# Altium project smartmcu.PrjPcb
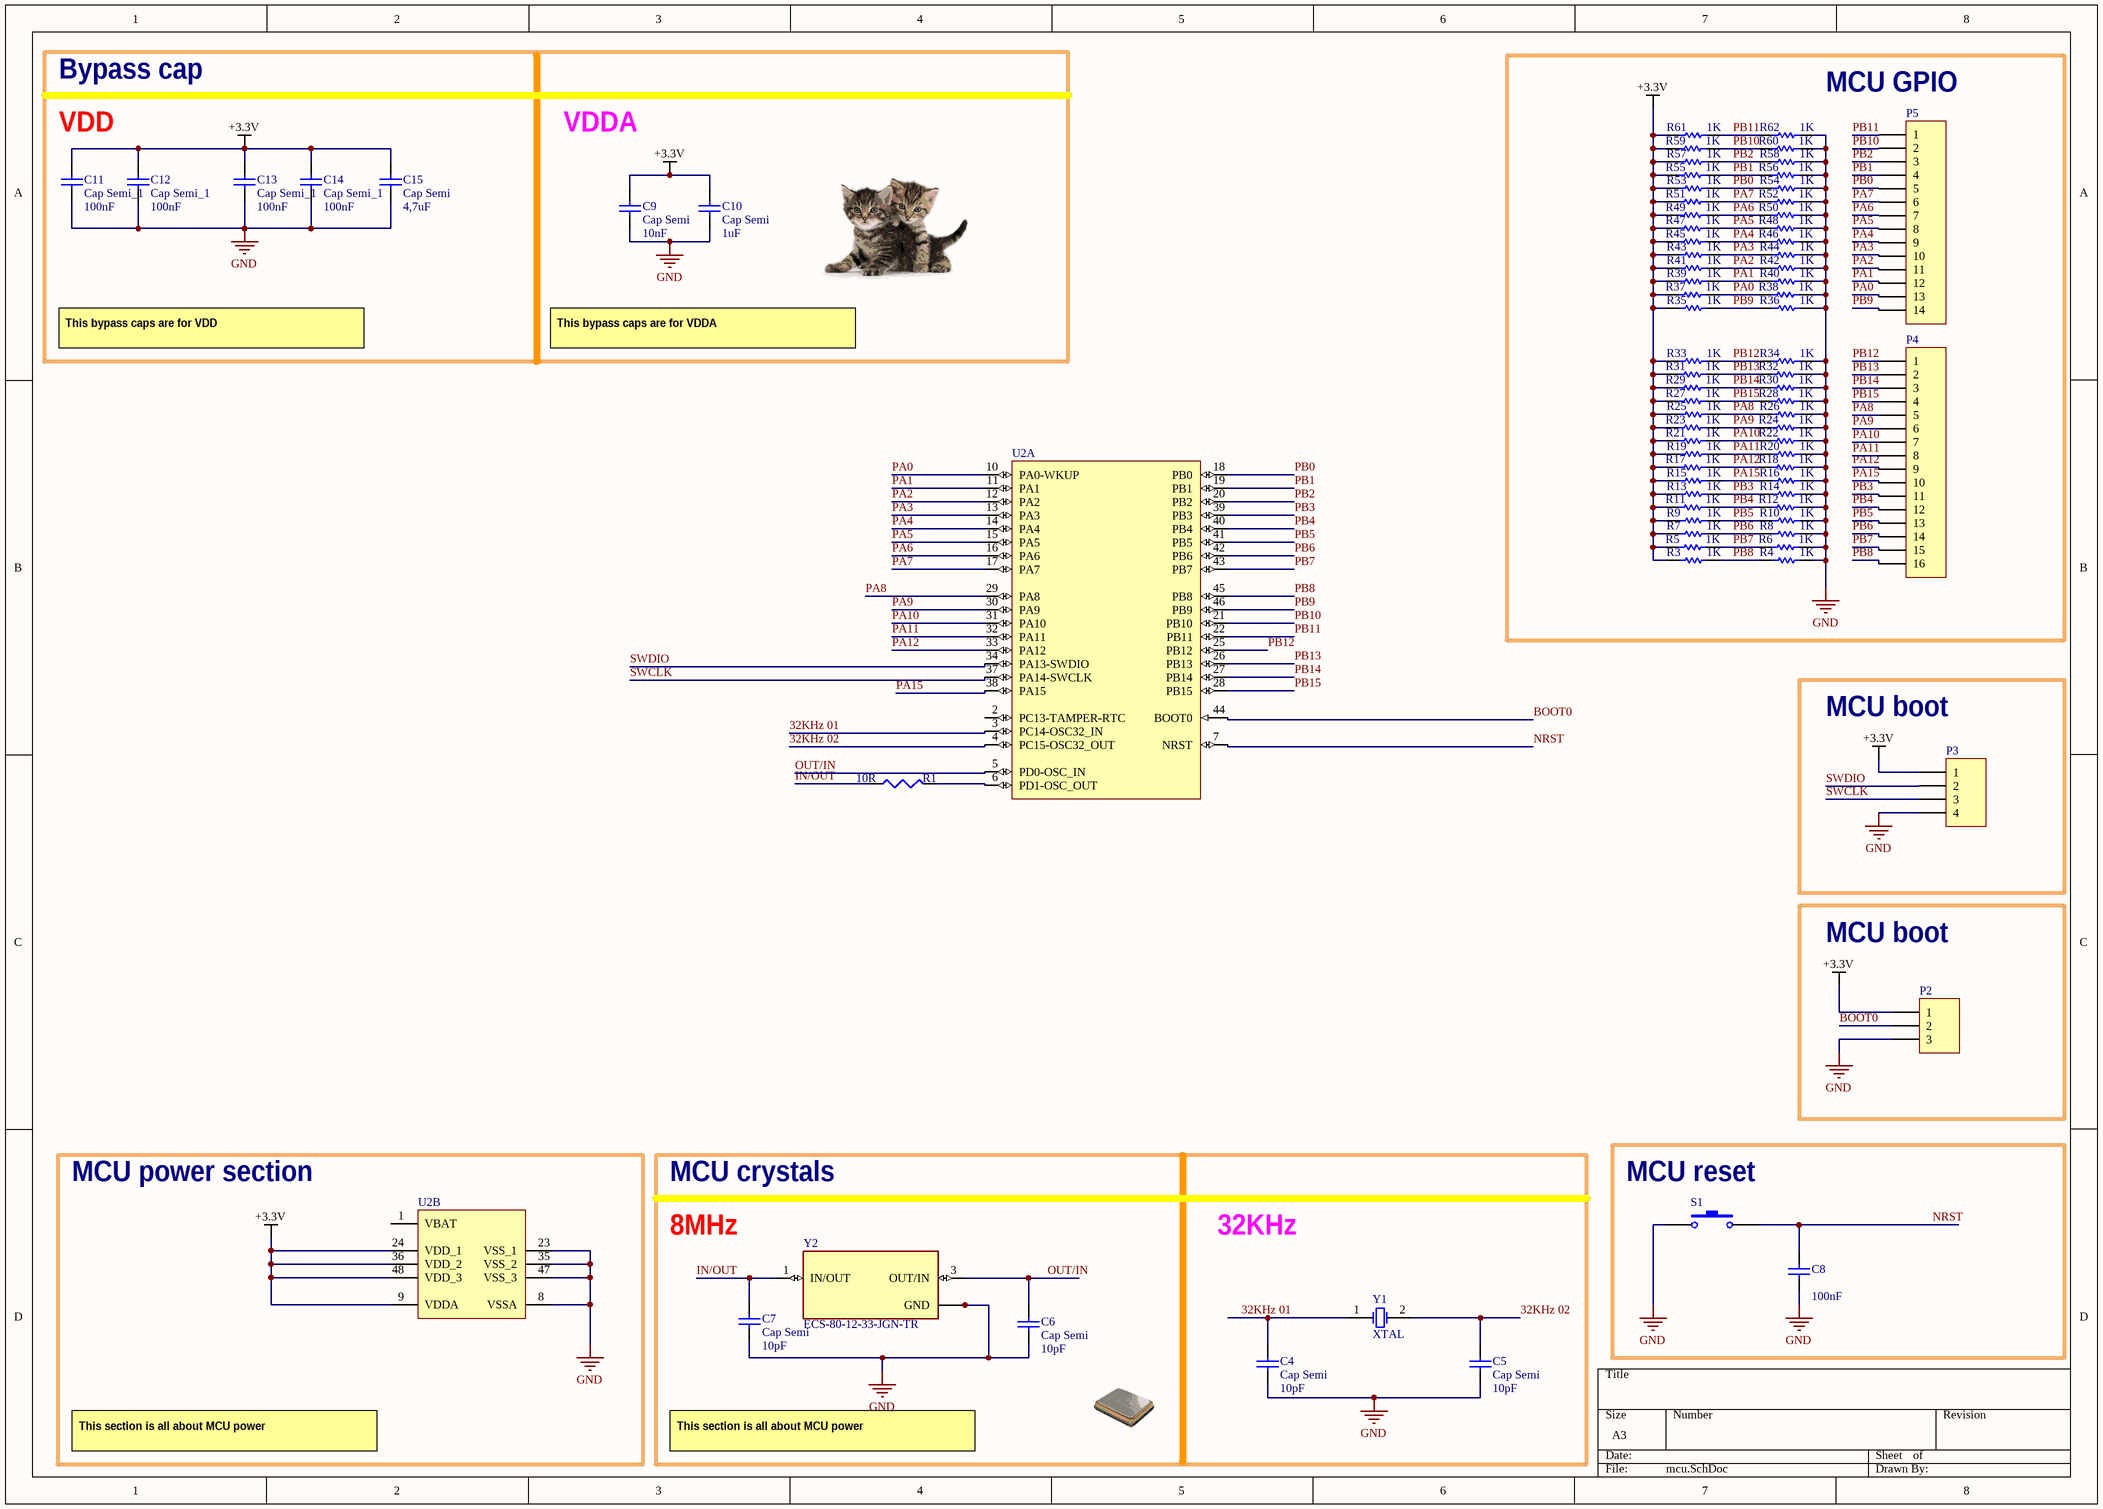
[diagram p0: mcu.SchDoc]
date: 2023; designer: Igor Vashkevich; my tittle: smart mcu project
3 sheets, 88 parts. Net scope: global (net labels, ports and power ports of the same name join across sheets).
Board file: smarmcuPcb.PcbDoc
Sheets:
  main.SchDoc
  mcu.SchDoc
  PowerSupply.SchDoc

## Sheet main.SchDoc
size A4; Author: Igor Vashkevich; SheetNumber: 1; SheetTotal: 3

## Sheet mcu.SchDoc
size A3; SheetNumber: 2; SheetTotal: 3

### Parts
C4  Cap Semi  value 10pF  [0402]
C5  Cap Semi  value 10pF  [0402]
C6  Cap Semi  value 10pF  [0402]
C7  Cap Semi  value 10pF  [0402]
C8  value 100nF  [1608[0603]]
C9  Cap Semi  value 10nF  [1608[0603]]
C10  Cap Semi  value 1uF  [1608[0603]]
C11  Cap Semi_1  value 100nF  [1608[0603]cap]
C12  Cap Semi_1  value 100nF  [1608[0603]cap]
C13  Cap Semi_1  value 100nF  [1608[0603]cap]
C14  Cap Semi_1  value 100nF  [1608[0603]cap]
C15  Cap Semi  value 4,7uF  [1608[0603]cap]
P2  (no value)  [MHDR1X3body]
P3  (no value)  [MHDR1X4body]
P4  Header 16  [MY_FE16]  (value not drawn)
P5  Header 14  [MY_FE14]  (value not drawn)
R1  value 10R  [J1-0603]  (hidden comment: Res3)
R3  1K  [MY_0603]
R4  1K  [MY_0603]
R5  1K  [MY_0603]
R6  1K  [MY_0603]
R7  1K  [MY_0603]
R8  1K  [MY_0603]
R9  1K  [MY_0603]
R10  1K  [MY_0603]
R11  1K  [MY_0603]
R12  1K  [MY_0603]
R13  1K  [MY_0603]
R14  1K  [MY_0603]
R15  1K  [MY_0603]
R16  1K  [MY_0603]
R17  1K  [MY_0603]
R18  1K  [MY_0603]
R19  1K  [MY_0603]
R20  1K  [MY_0603]
R21  1K  [MY_0603]
R22  1K  [MY_0603]
R23  1K  [MY_0603]
R24  1K  [MY_0603]
R25  1K  [MY_0603]
R26  1K  [MY_0603]
R27  1K  [MY_0603]
R28  1K  [MY_0603]
R29  1K  [MY_0603]
R30  1K  [MY_0603]
R31  1K  [MY_0603]
R32  1K  [MY_0603]
R33  1K  [MY_0603]
R34  1K  [MY_0603]
R35  1K  [MY_0603]
R36  1K  [MY_0603]
R37  1K  [MY_0603]
R38  1K  [MY_0603]
R39  1K  [MY_0603]
R40  1K  [MY_0603]
R41  1K  [MY_0603]
R42  1K  [MY_0603]
R43  1K  [MY_0603]
R44  1K  [MY_0603]
R45  1K  [MY_0603]
R46  1K  [MY_0603]
R47  1K  [MY_0603]
R48  1K  [MY_0603]
R49  1K  [MY_0603]
R50  1K  [MY_0603]
R51  1K  [MY_0603]
R52  1K  [MY_0603]
R53  1K  [MY_0603]
R54  1K  [MY_0603]
R55  1K  [MY_0603]
R56  1K  [MY_0603]
R57  1K  [MY_0603]
R58  1K  [MY_0603]
R59  1K  [MY_0603]
R60  1K  [MY_0603]
R61  1K  [MY_0603]
R62  1K  [MY_0603]
S1  (no value)  [SPST-2_body]
U2  (no value)  [STM-LQFP48_N]  (parts A,B of 2)
Y1  XTAL  [R38]
Y2  ECS-80-12-33-JGN-TR  [XTAL_ECS-240-8-33-AGN-TR]

### Blocks framed on the sheet
MCU GPIO: P4 P5 R3-R62
MCU boot: P3
MCU boot: P2
MCU reset: C8 S1
MCU power section: U2

### Nets
+3.3V: C9.2 C10.2 C11.2 C12.2 C13.2 C14.2 C15.2 P2.1 P3.1 R3.1 R5.1 R7.1 R9.1 R11.1 R13.1 R15.1 R17.1 R19.1 R21.1 R23.1 R25.1 R27.1 R29.1 R31.1 R33.1 R35.1 R37.1 R39.1 R41.1 R43.1 R45.1 R47.1 R49.1 R51.1 R53.1 R55.1 R57.1 R59.1 R61.1 U2.9(VDDA) U2.24(VDD_1) U2.36(VDD_2) U2.48(VDD_3)
GND: C4.1 C5.1 C6.1 C7.1 C8.1 C9.1 C10.1 C11.1 C12.1 C13.1 C14.1 C15.1 P2.3 P3.4 R4.2 R6.2 R8.2 R10.2 R12.2 R14.2 R16.2 R18.2 R20.2 R22.2 R24.2 R26.2 R28.2 R30.2 R32.2 R34.2 R36.2 R38.2 R40.2 R42.2 R44.2 R46.2 R48.2 R50.2 R52.2 R54.2 R56.2 R58.2 R60.2 R62.2 S1.1 U2.8(VSSA) U2.23(VSS_1) U2.35(VSS_2) U2.47(VSS_3) Y2.2(GND) Y2.4(GND)
32KHz 01: C4.2 U2.3(PC14-OSC32_IN) Y1.1(OSC1)
32KHz 02: C5.2 U2.4(PC15-OSC32_OUT) Y1.2(OSC2)
BOOT0: P2.2 U2.44(BOOT0)
IN/OUT: C7.2 R1.1 Y2.1(IN/OUT)
NRST: C8.2 S1.2 U2.7(NRST)
OUT/IN: C6.2 U2.5(PD0-OSC_IN) Y2.3(OUT/IN)
PA0: P5.13 R37.2 R38.1 U2.10(PA0-WKUP)
PA1: P5.12 R39.2 R40.1 U2.11(PA1)
PA2: P5.11 R41.2 R42.1 U2.12(PA2)
PA3: P5.10 R43.2 R44.1 U2.13(PA3)
PA4: P5.9 R45.2 R46.1 U2.14(PA4)
PA5: P5.8 R47.2 R48.1 U2.15(PA5)
PA6: P5.7 R49.2 R50.1 U2.16(PA6)
PA7: P5.6 R51.2 R52.1 U2.17(PA7)
PA8: P4.5 R25.2 R26.1 U2.29(PA8)
PA9: P4.6 R23.2 R24.1 U2.30(PA9)
PA10: P4.7 R21.2 R22.1 U2.31(PA10)
PA11: P4.8 R19.2 R20.1 U2.32(PA11)
PA12: P4.9 R17.2 R18.1 U2.33(PA12)
PA15: P4.10 R15.2 R16.1 U2.38(PA15)
PB0: P5.5 R53.2 R54.1 U2.18(PB0)
PB1: P5.4 R55.2 R56.1 U2.19(PB1)
PB2: P5.3 R57.2 R58.1 U2.20(PB2)
PB3: P4.11 R13.2 R14.1 U2.39(PB3)
PB4: P4.12 R11.2 R12.1 U2.40(PB4)
PB5: P4.13 R9.2 R10.1 U2.41(PB5)
PB6: P4.14 R7.2 R8.1 U2.42(PB6)
PB7: P4.15 R5.2 R6.1 U2.43(PB7)
PB8: P4.16 R3.2 R4.1 U2.45(PB8)
PB9: P5.14 R35.2 R36.1 U2.46(PB9)
PB10: P5.2 R59.2 R60.1 U2.21(PB10)
PB11: P5.1 R61.2 R62.1 U2.22(PB11)
PB12: P4.1 R33.2 R34.1 U2.25(PB12)
PB13: P4.2 R31.2 R32.1 U2.26(PB13)
PB14: P4.3 R29.2 R30.1 U2.27(PB14)
PB15: P4.4 R27.2 R28.1 U2.28(PB15)
SWCLK: P3.3 U2.37(PA14-SWCLK)
SWDIO: P3.2 U2.34(PA13-SWDIO)
NetR1_2: R1.2 U2.6(PD1-OSC_OUT)

Not connected (* = marked no-connect by the designer): U2 1(VBAT) 2(PC13-TAMPER-RTC)

### Notes on the sheet
- Bypass cap
- VDD
- VDDA
- This bypass caps are for VDD
- This bypass caps are for VDDA
- MCU crystals
- 8MHz
- 32KHz
- This section is all about MCU power

### Library data of the parts
C4-C10 C15 = Cap Semi: Capacitor (Semiconductor SIM Model); Published: 8-Jun-2000; LatestRevisionDate: 29-May-2009; LatestRevisionNote: IPC-7351 Footprint Added.; PackageReference: C1206; Publisher: Altium Limited; PackageDescription: Chip Capacitor
C11 C12 = Cap Semi_1: Capacitor (Semiconductor SIM Model); Published: 8-Jun-2000; LatestRevisionDate: 29-May-2009; LatestRevisionNote: IPC-7351 Footprint Added.; PackageReference: C1206; Publisher: Altium Limited; PackageDescription: Chip Capacitor
C13 = Cap Semi_1_2: Capacitor (Semiconductor SIM Model); Published: 8-Jun-2000; LatestRevisionDate: 29-May-2009; LatestRevisionNote: IPC-7351 Footprint Added.; PackageReference: C1206; Publisher: Altium Limited; PackageDescription: Chip Capacitor
C14 = Cap Semi_1_3: Capacitor (Semiconductor SIM Model); Published: 8-Jun-2000; LatestRevisionDate: 29-May-2009; LatestRevisionNote: IPC-7351 Footprint Added.; PackageReference: C1206; Publisher: Altium Limited; PackageDescription: Chip Capacitor
P2 = MHDR1X3: Header, 3-Pin; LatestRevisionDate: 17-Jul-2002; LatestRevisionNote: Re-released for DXP Platform.; Publisher: Altium Limited
P3 = MHDR1X4: Header, 4-Pin; LatestRevisionDate: 17-Jul-2002; LatestRevisionNote: Re-released for DXP Platform.; Publisher: Altium Limited
P4 = Header 16: Header, 16-Pin; ASiD Part Number: Header 16-AS
P5 = Header 14: Header, 14-Pin; ASiD Part Number: Header 14-AS
R1 = Res3: Resistor; Published: 8-Jun-2000; LatestRevisionDate: 29-May-2009; LatestRevisionNote: IPC-7351 Footprint Added.; PackageReference: J1-0603; Publisher: Altium Limited; PackageDescription: Chip Resistor
R3-R62 = Res: Standard resistor; ASiD Part Number: Res-AS; Value: 1K
S1 = SW-PB: Switch; Published: 24-Mar-1999; LatestRevisionDate: 17-Jul-2002; LatestRevisionNote: Re-released for DXP Platform.; PackageReference: SPST-2; Publisher: Altium Limited; PackageDescription: Switch; 2 Leads
U2 = STM32F103C8T6: ARM Cortex-M3 32-bit MCU, 64 KB Flash, 20 KB Internal RAM, 37 I/Os, 48-pin LQFP, -40 to 85 degC, Tray; A/D Converter: 2x12-bit (10 Channel); FLASH Size (Prog) (kB): 64; I/Os (High Current): 37; Internal RAM Size (kB): 20; Operating Frequency(F) (Processor speed) (MHz): 72; Supply Voltage(Vcc) min (V): 2; DatasheetVersion: Rev. 16; PackageVersion: Rev. 6, 06/2013; PackageReference: LQFP48; PackageDescription: 48-Pin Low Profile Quad Flat Package, 7 x 7 mm Body, 0.5 mm Pitch; Supplier 1: Digi-Key; Supplier Part Number 1: 497-6063-ND; Supplier 2: Farnell; Supplier Part Number 2: 1447637; Supplier 3: Newark; Supplier Part Number 3: 59M2182; Supplier 4: Newark; Supplier Part Number 4: 57P1222; Supplier 5: Mouser; Supplier Part Number 5: 511-STM32F103C8T6; Core: ARM Cortex-M3; Packing: Tray; Mounting Technology: Surface Mount; PartNumber: STM32F103C8T6; ComponentLink1Description: Manufacturer URL; ComponentLink1URL: http://www.st.com/web/en/home.html; ComponentLink2Description: Datasheet; ComponentLink2URL: http://www.st.com/st-web-ui/static/active/en/resource/technical/document/datasheet/CD00161566.pdf; ComponentLink3Description: Package Specification; ComponentLink3URL: http://www.st.com/st-web-ui/static/active/en/resource/technical/document/datasheet/DM00058181.pdf
Y1 = XTAL: Crystal Oscillator; Published: 8-Jun-2000; LatestRevisionDate: 17-Jul-2002; LatestRevisionNote: Re-released for DXP Platform.; PackageReference: R38; Publisher: Altium Limited; PackageDescription: Crystal, Thru-Hole; 2 Leads; Body 3.1 x 8.2 mm (Dia.xH)
Y2 = ECS-80-12-33-JGN-TR: 8MHz Â±20ppm Crystal 12pF 400 Ohms 4-SMD, No Lead; MF: ECS Inc.; Package: SMD-4 ECS International; MP: ECS-80-12-33-JGN-TR; Value: *; Availability: Warning; Price: None; SnapEDA_Link: https://www.snapeda.com/parts/ECS-80-12-33-JGN-TR/ECS%20Inc./view-part/4477300/?ref=snap; Mouser-Purchase-URL: https://snapeda.com/shop?store=Mouser&id=4477300; BuyPart: https://www.snapeda.com/parts/ECS-80-12-33-JGN-TR/ECS%20Inc./view-part/4477300/?ref=eda

## Sheet PowerSupply.SchDoc
size A3; SheetNumber: 3; SheetTotal: 3
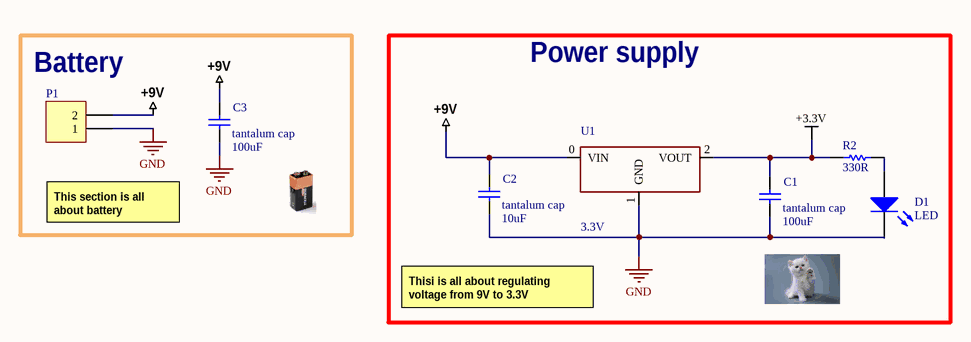
[diagram p1: PowerSupply.SchDoc]

### Parts
C1  tantalum cap  value 100uF  [C1206tancap]
C2  tantalum cap  value 10uF  [C1206tancap]
C3  tantalum cap  value 100uF  [C1206tancap]
D1  LED  [MY_LED_0805]
P1  (no value)  [HDR1X2H3dbody]
R2  330R  [MY_0805]
U1  Voltage: 3.3V  [4 PIN-SOT]

### Blocks framed on the sheet
Battery: C3 P1
Power supply: C1 C2 D1 R2 U1

### Nets
+3.3V: C1.2 R2.1 U1.2(VOUT)
+9V: C2.2 C3.2 P1.2 U1.0(VIN)
GND: C1.1 C2.1 C3.1 D1.K P1.1 U1.1(GND)
NetD1_A: D1.A R2.2

### Notes on the sheet
- This section is all about battery
- Thisi is all about regulating voltage from 9V to 3.3V

### Library data of the parts
C1 C3 = Cap Semi_6: Capacitor (Semiconductor SIM Model); Published: 8-Jun-2000; LatestRevisionDate: 29-May-2009; LatestRevisionNote: IPC-7351 Footprint Added.; PackageReference: C1206; Publisher: Altium Limited; PackageDescription: Chip Capacitor
C2 = Cap Semi_5: Capacitor (Semiconductor SIM Model); Published: 8-Jun-2000; LatestRevisionDate: 29-May-2009; LatestRevisionNote: IPC-7351 Footprint Added.; PackageReference: C1206; Publisher: Altium Limited; PackageDescription: Chip Capacitor
D1 = LED: Typical INFRARED GaAs LED; ASiD Part Number: LED-AS
P1 = Header 2H: Battery connection; voltage: 5V; LatestRevisionDate: 17-Jul-2002; LatestRevisionNote: Re-released for DXP Platform.; Publisher: Altium Limited
R2 = Res: as R3 on sheet mcu; Value: 330R
U1 = lm1117: The LM1117 is a low dropout voltage regulator with a dropout of / 1.2 V at 800 mA of load current. The LM1117 is available in an / adjustable version, which can set the output voltage from 1.25 to / 13.8 V with only two external resistors. In addition, it is available in / five fixed voltages, 1.8 V, 2.5 V, 3.3 V, and 5 V. / The LM1117 offers current limiting and thermal shutdown. Its / circuit is trimmed to assure output voltage accuracy to within +/−1%

## Nets that join several sheets
+3.3V: mcu (43 pins), PowerSupply (C1.2 R2.1 U1.2)
GND: mcu (51 pins), PowerSupply (6 pins)